# Altium project TASK9_PCB.PrjPcb
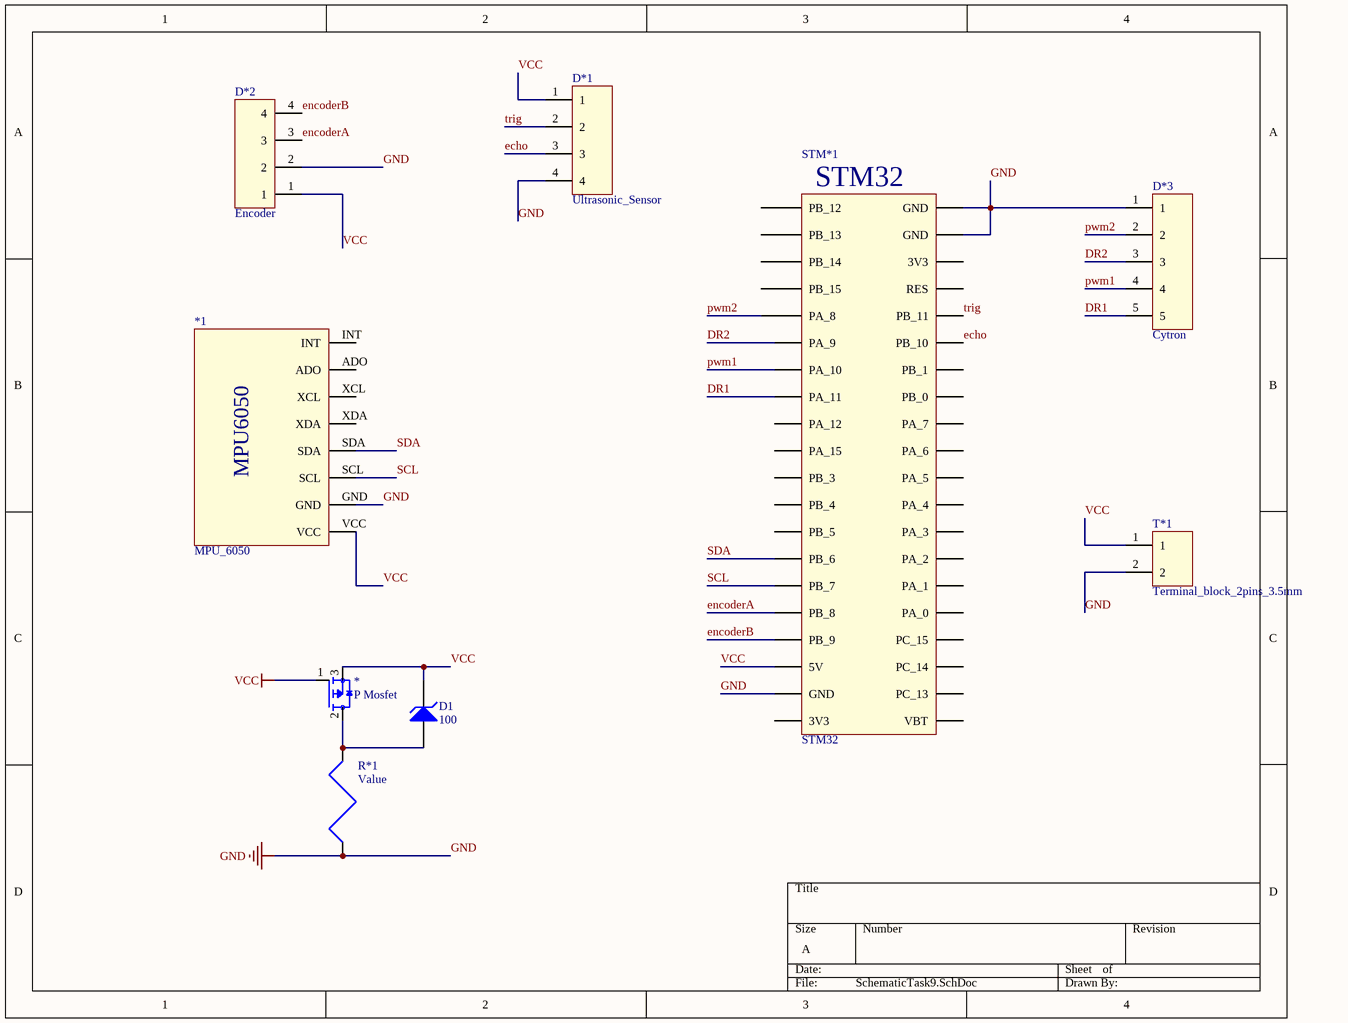
[diagram p0: SchematicTask9.SchDoc]
1 sheet, 9 parts. Net scope: global (net labels, ports and power ports of the same name join across sheets).
Board file: PCB1.PcbDoc

## Sheet SchematicTask9.SchDoc
size A; SheetNumber: 1; SheetTotal: 1

### Parts
*  P Mosfet  [Mosfet]
*1  MPU_6050  [MPU6050]
D1  BV: 100  (hidden comment: Zener Diode)
D*1  Ultrasonic_Sensor  [DATA_PIN_HEADER_4_2.54m]
D*2  Encoder  [DATA_PIN_HEADER_4_2.54m]
D*3  Cytron  [DATA_PIN_HEADER_5_2.54m]
R*1  Value  [Resistor]
STM*1  STM32  [STM32]
T*1  Terminal_block_2pins_3.5mm  [Terminal_block_2pins_3.5mm]

### Nets
\: *.1(G) *.3(S) *1.VCC D1.2(K) D*1.1 D*2.1 STM*1.5V T*1.1  [also labelled VCC]
GND: *1.GND D*1.4 D*2.2 D*3.1 R*1.1 STM*1.GND T*1.2
DR1: D*3.5 STM*1.PA_11
DR2: D*3.3 STM*1.PA_9
echo: D*1.3 STM*1.PB_10
encoderA: D*2.3 STM*1.PB_8
encoderB: D*2.4 STM*1.PB_9
pwm1: D*3.4 STM*1.PA_10
pwm2: D*3.2 STM*1.PA_8
SCL: *1.SCL STM*1.PB_7
SDA: *1.SDA STM*1.PB_6
trig: D*1.2 STM*1.PB_11
Net*_2: *.2(D) D1.1(A) R*1.2

Not connected (* = marked no-connect by the designer): *1 ADO INT XCL XDA; STM*1 3V3 PA_0 PA_1 PA_2 PA_3 PA_4 PA_5 PA_6 PA_7 PA_12 PA_15 PB_0 PB_1 PB_3 PB_4 PB_5 PB_12 PB_13 PB_14 PB_15 PC_13 PC_14 PC_15 RES VBT

### Notes on the sheet
- (in symbol MPU_6050) MPU6050

### Library data of the parts
D1 = Zener Diode: AF: 1; BV_MAX: 1e99; CJO: 0; EG: 1.11; FC: 0.5; IBV: 0.001; IS: 1e-14; MJSW: 0.33; NTUN: 30; TNOM: 27; XTI: 3; SimulationGenericComponent: True; CJP: 0; CTA: 0; CTP: 0; FCS: 0.5; FV_MAX: 1e99; IKF: 0; IKR: 0; ISR: 1e-14; JSW: 0; JTUN: 0; JTUNSW: 0; KEG: 1; KF: 0; LEVEL: 1; N: 1; NBV: 1; NR: 1; NS: 1; PHP: 1; RS: 0; TCV: 0; TLEV: 0; TLEVC: 0; TM1: 0; TM2: 0; TPB: 0; TPHP: 0; TRS: 0; TRS2: 0; TT: 0; TTT1: 0; TTT2: 0; VJ: 1; XTITUN: 3
D*1 D*2 = DATA_PIN_HEADER_4_2.54m
D*3 = DATA_PIN_HEADER_5_2.54m
R*1 = Resistor